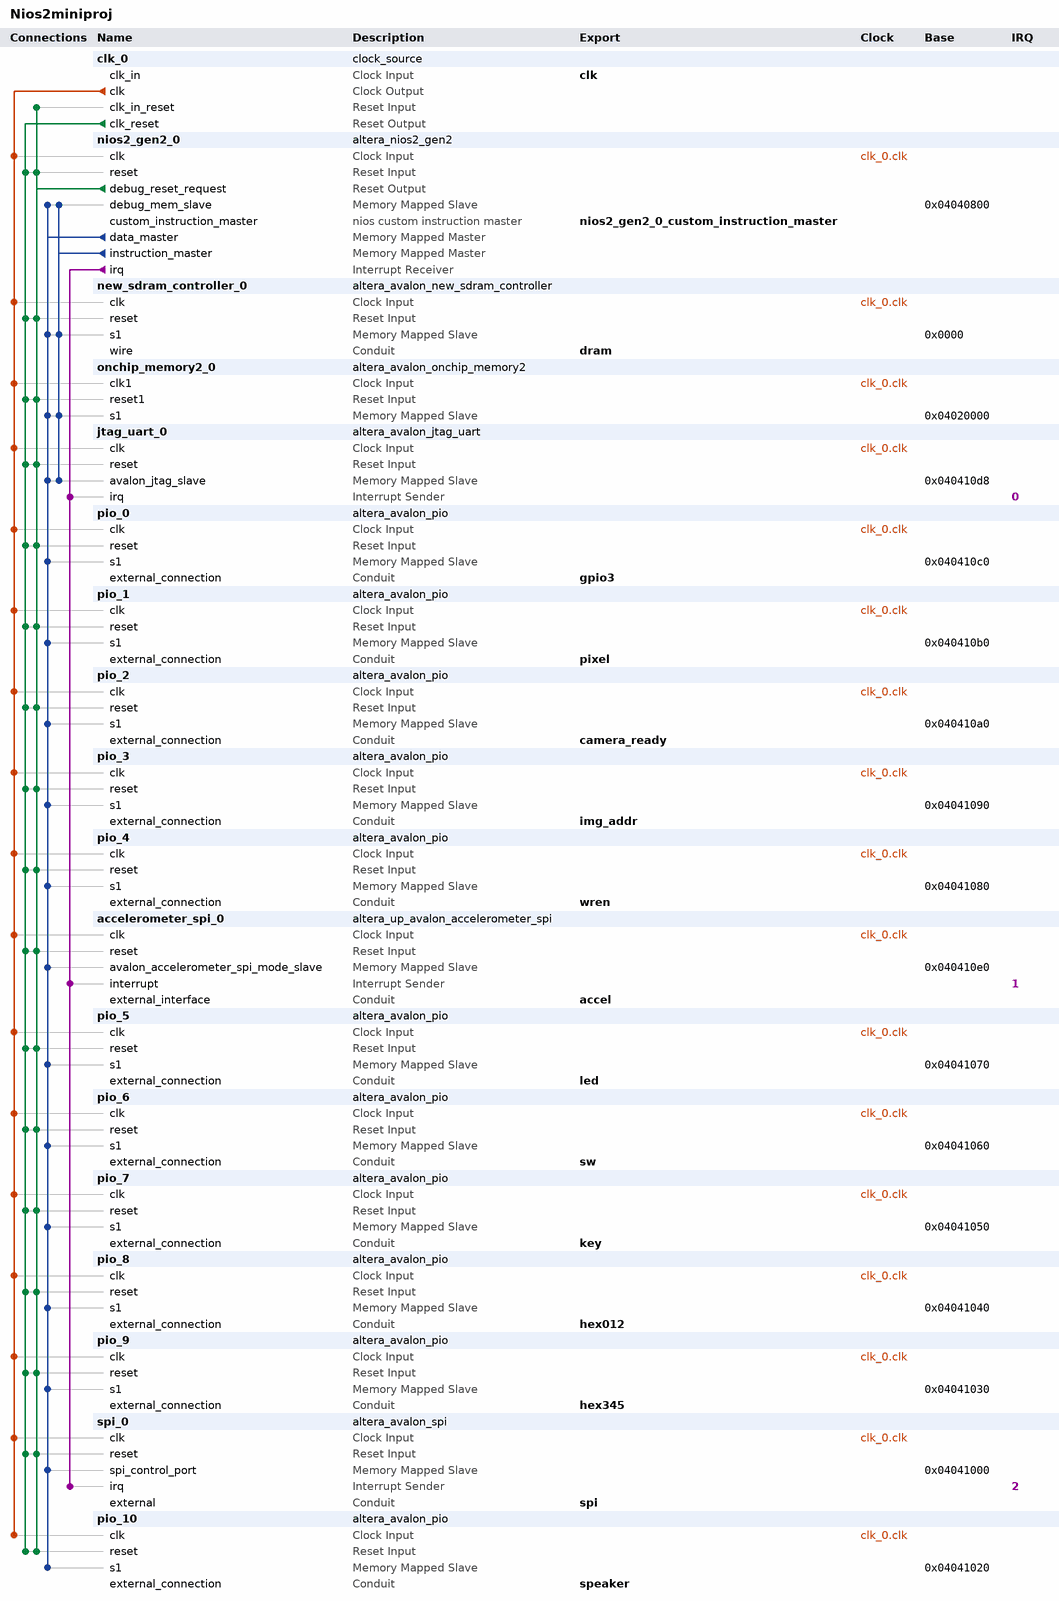
[diagram p0: system contents]
# Platform Designer (Qsys) system Nios2miniproj, MAX 10 10M50DAF484C7G
# Parameters at their usual value, and those the tool derives, are not listed.
package require -exact qsys 18.1
create_system Nios2miniproj
set_project_property DEVICE_FAMILY {MAX 10}
set_project_property DEVICE 10M50DAF484C7G

add_instance clk_0 clock_source 18.1
set_instance_parameter_value clk_0 clockFrequency 50000000

add_instance nios2_gen2_0 altera_nios2_gen2 18.1
set_instance_parameter_value nios2_gen2_0 dcache_size 2048
set_instance_parameter_value nios2_gen2_0 exceptionSlave new_sdram_controller_0.s1
set_instance_parameter_value nios2_gen2_0 icache_size 4096
set_instance_parameter_value nios2_gen2_0 impl Fast
set_instance_parameter_value nios2_gen2_0 resetSlave new_sdram_controller_0.s1

add_instance new_sdram_controller_0 altera_avalon_new_sdram_controller 18.1
set_instance_parameter_value new_sdram_controller_0 TAC 5.5
set_instance_parameter_value new_sdram_controller_0 TRCD 20.0
set_instance_parameter_value new_sdram_controller_0 TRP 20.0
set_instance_parameter_value new_sdram_controller_0 casLatency 3
set_instance_parameter_value new_sdram_controller_0 columnWidth 10
set_instance_parameter_value new_sdram_controller_0 dataWidth 16
set_instance_parameter_value new_sdram_controller_0 generateSimulationModel false
set_instance_parameter_value new_sdram_controller_0 model single_Micron_MT48LC4M32B2_7_chip
set_instance_parameter_value new_sdram_controller_0 numberOfBanks 4
set_instance_parameter_value new_sdram_controller_0 numberOfChipSelects 1
set_instance_parameter_value new_sdram_controller_0 powerUpDelay 100.0
set_instance_parameter_value new_sdram_controller_0 refreshPeriod 15.625
set_instance_parameter_value new_sdram_controller_0 rowWidth 13

add_instance onchip_memory2_0 altera_avalon_onchip_memory2 18.1
set_instance_parameter_value onchip_memory2_0 dataWidth 32
set_instance_parameter_value onchip_memory2_0 dualPort false
set_instance_parameter_value onchip_memory2_0 initMemContent true
set_instance_parameter_value onchip_memory2_0 initializationFileName onchip_mem.hex
set_instance_parameter_value onchip_memory2_0 memorySize 100000

add_instance jtag_uart_0 altera_avalon_jtag_uart 18.1
set_instance_parameter_value jtag_uart_0 simInteractiveOptions NO_INTERACTIVE_WINDOWS

add_instance pio_0 altera_avalon_pio 18.1
set_instance_parameter_value pio_0 direction Output
set_instance_parameter_value pio_0 width 1

add_instance pio_1 altera_avalon_pio 18.1
set_instance_parameter_value pio_1 direction Output
set_instance_parameter_value pio_1 width 4

add_instance pio_2 altera_avalon_pio 18.1
set_instance_parameter_value pio_2 direction Input
set_instance_parameter_value pio_2 width 1

add_instance pio_3 altera_avalon_pio 18.1
set_instance_parameter_value pio_3 direction Output
set_instance_parameter_value pio_3 width 17

add_instance pio_4 altera_avalon_pio 18.1
set_instance_parameter_value pio_4 direction Output
set_instance_parameter_value pio_4 width 1

add_instance accelerometer_spi_0 altera_up_avalon_accelerometer_spi 18.0

add_instance pio_5 altera_avalon_pio 18.1
set_instance_parameter_value pio_5 direction Output
set_instance_parameter_value pio_5 width 10

add_instance pio_6 altera_avalon_pio 18.1
set_instance_parameter_value pio_6 direction Input
set_instance_parameter_value pio_6 width 10

add_instance pio_7 altera_avalon_pio 18.1
set_instance_parameter_value pio_7 direction Input
set_instance_parameter_value pio_7 width 2

add_instance pio_8 altera_avalon_pio 18.1
set_instance_parameter_value pio_8 direction Output
set_instance_parameter_value pio_8 width 24

add_instance pio_9 altera_avalon_pio 18.1
set_instance_parameter_value pio_9 direction Output
set_instance_parameter_value pio_9 width 24

add_instance spi_0 altera_avalon_spi 18.1
set_instance_parameter_value spi_0 clockPhase 1
set_instance_parameter_value spi_0 clockPolarity 1
set_instance_parameter_value spi_0 dataWidth 8
set_instance_parameter_value spi_0 masterSPI true
set_instance_parameter_value spi_0 numberOfSlaves 2
set_instance_parameter_value spi_0 targetClockRate 5000000

add_instance pio_10 altera_avalon_pio 18.1
set_instance_parameter_value pio_10 direction Output
set_instance_parameter_value pio_10 width 1

# connections
add_connection clk_0.clk accelerometer_spi_0.clk clock
add_connection clk_0.clk jtag_uart_0.clk clock
add_connection clk_0.clk new_sdram_controller_0.clk clock
add_connection clk_0.clk nios2_gen2_0.clk clock
add_connection clk_0.clk onchip_memory2_0.clk1 clock
add_connection clk_0.clk pio_0.clk clock
add_connection clk_0.clk pio_1.clk clock
add_connection clk_0.clk pio_2.clk clock
add_connection clk_0.clk pio_3.clk clock
add_connection clk_0.clk pio_4.clk clock
add_connection clk_0.clk pio_5.clk clock
add_connection clk_0.clk pio_6.clk clock
add_connection clk_0.clk pio_7.clk clock
add_connection clk_0.clk pio_8.clk clock
add_connection clk_0.clk pio_9.clk clock
add_connection clk_0.clk pio_10.clk clock
add_connection clk_0.clk spi_0.clk clock
add_connection clk_0.clk_reset accelerometer_spi_0.reset reset
add_connection clk_0.clk_reset jtag_uart_0.reset reset
add_connection clk_0.clk_reset new_sdram_controller_0.reset reset
add_connection clk_0.clk_reset nios2_gen2_0.reset reset
add_connection clk_0.clk_reset onchip_memory2_0.reset1 reset
add_connection clk_0.clk_reset pio_0.reset reset
add_connection clk_0.clk_reset pio_1.reset reset
add_connection clk_0.clk_reset pio_2.reset reset
add_connection clk_0.clk_reset pio_3.reset reset
add_connection clk_0.clk_reset pio_4.reset reset
add_connection clk_0.clk_reset pio_5.reset reset
add_connection clk_0.clk_reset pio_6.reset reset
add_connection clk_0.clk_reset pio_7.reset reset
add_connection clk_0.clk_reset pio_8.reset reset
add_connection clk_0.clk_reset pio_9.reset reset
add_connection clk_0.clk_reset pio_10.reset reset
add_connection clk_0.clk_reset spi_0.reset reset
add_connection nios2_gen2_0.debug_reset_request accelerometer_spi_0.reset reset
add_connection nios2_gen2_0.debug_reset_request clk_0.clk_in_reset reset
add_connection nios2_gen2_0.debug_reset_request jtag_uart_0.reset reset
add_connection nios2_gen2_0.debug_reset_request new_sdram_controller_0.reset reset
add_connection nios2_gen2_0.debug_reset_request nios2_gen2_0.reset reset
add_connection nios2_gen2_0.debug_reset_request onchip_memory2_0.reset1 reset
add_connection nios2_gen2_0.debug_reset_request pio_0.reset reset
add_connection nios2_gen2_0.debug_reset_request pio_1.reset reset
add_connection nios2_gen2_0.debug_reset_request pio_2.reset reset
add_connection nios2_gen2_0.debug_reset_request pio_3.reset reset
add_connection nios2_gen2_0.debug_reset_request pio_4.reset reset
add_connection nios2_gen2_0.debug_reset_request pio_5.reset reset
add_connection nios2_gen2_0.debug_reset_request pio_6.reset reset
add_connection nios2_gen2_0.debug_reset_request pio_7.reset reset
add_connection nios2_gen2_0.debug_reset_request pio_8.reset reset
add_connection nios2_gen2_0.debug_reset_request pio_9.reset reset
add_connection nios2_gen2_0.debug_reset_request pio_10.reset reset
add_connection nios2_gen2_0.debug_reset_request spi_0.reset reset
add_connection nios2_gen2_0.data_master accelerometer_spi_0.avalon_accelerometer_spi_mode_slave avalon
set_connection_parameter_value nios2_gen2_0.data_master/accelerometer_spi_0.avalon_accelerometer_spi_mode_slave baseAddress 0x040410e0
add_connection nios2_gen2_0.data_master jtag_uart_0.avalon_jtag_slave avalon
set_connection_parameter_value nios2_gen2_0.data_master/jtag_uart_0.avalon_jtag_slave baseAddress 0x040410d8
add_connection nios2_gen2_0.data_master new_sdram_controller_0.s1 avalon
set_connection_parameter_value nios2_gen2_0.data_master/new_sdram_controller_0.s1 baseAddress 0x0000
add_connection nios2_gen2_0.data_master nios2_gen2_0.debug_mem_slave avalon
set_connection_parameter_value nios2_gen2_0.data_master/nios2_gen2_0.debug_mem_slave baseAddress 0x04040800
add_connection nios2_gen2_0.data_master onchip_memory2_0.s1 avalon
set_connection_parameter_value nios2_gen2_0.data_master/onchip_memory2_0.s1 baseAddress 0x04020000
add_connection nios2_gen2_0.data_master pio_0.s1 avalon
set_connection_parameter_value nios2_gen2_0.data_master/pio_0.s1 baseAddress 0x040410c0
add_connection nios2_gen2_0.data_master pio_1.s1 avalon
set_connection_parameter_value nios2_gen2_0.data_master/pio_1.s1 baseAddress 0x040410b0
add_connection nios2_gen2_0.data_master pio_2.s1 avalon
set_connection_parameter_value nios2_gen2_0.data_master/pio_2.s1 baseAddress 0x040410a0
add_connection nios2_gen2_0.data_master pio_3.s1 avalon
set_connection_parameter_value nios2_gen2_0.data_master/pio_3.s1 baseAddress 0x04041090
add_connection nios2_gen2_0.data_master pio_4.s1 avalon
set_connection_parameter_value nios2_gen2_0.data_master/pio_4.s1 baseAddress 0x04041080
add_connection nios2_gen2_0.data_master pio_5.s1 avalon
set_connection_parameter_value nios2_gen2_0.data_master/pio_5.s1 baseAddress 0x04041070
add_connection nios2_gen2_0.data_master pio_6.s1 avalon
set_connection_parameter_value nios2_gen2_0.data_master/pio_6.s1 baseAddress 0x04041060
add_connection nios2_gen2_0.data_master pio_7.s1 avalon
set_connection_parameter_value nios2_gen2_0.data_master/pio_7.s1 baseAddress 0x04041050
add_connection nios2_gen2_0.data_master pio_8.s1 avalon
set_connection_parameter_value nios2_gen2_0.data_master/pio_8.s1 baseAddress 0x04041040
add_connection nios2_gen2_0.data_master pio_9.s1 avalon
set_connection_parameter_value nios2_gen2_0.data_master/pio_9.s1 baseAddress 0x04041030
add_connection nios2_gen2_0.data_master pio_10.s1 avalon
set_connection_parameter_value nios2_gen2_0.data_master/pio_10.s1 baseAddress 0x04041020
add_connection nios2_gen2_0.data_master spi_0.spi_control_port avalon
set_connection_parameter_value nios2_gen2_0.data_master/spi_0.spi_control_port baseAddress 0x04041000
add_connection nios2_gen2_0.instruction_master jtag_uart_0.avalon_jtag_slave avalon
set_connection_parameter_value nios2_gen2_0.instruction_master/jtag_uart_0.avalon_jtag_slave baseAddress 0x040410d8
add_connection nios2_gen2_0.instruction_master new_sdram_controller_0.s1 avalon
set_connection_parameter_value nios2_gen2_0.instruction_master/new_sdram_controller_0.s1 baseAddress 0x0000
add_connection nios2_gen2_0.instruction_master nios2_gen2_0.debug_mem_slave avalon
set_connection_parameter_value nios2_gen2_0.instruction_master/nios2_gen2_0.debug_mem_slave baseAddress 0x04040800
add_connection nios2_gen2_0.instruction_master onchip_memory2_0.s1 avalon
set_connection_parameter_value nios2_gen2_0.instruction_master/onchip_memory2_0.s1 baseAddress 0x04020000
add_connection nios2_gen2_0.irq accelerometer_spi_0.interrupt interrupt
set_connection_parameter_value nios2_gen2_0.irq/accelerometer_spi_0.interrupt irqNumber 1
add_connection nios2_gen2_0.irq jtag_uart_0.irq interrupt
set_connection_parameter_value nios2_gen2_0.irq/jtag_uart_0.irq irqNumber 0
add_connection nios2_gen2_0.irq spi_0.irq interrupt
set_connection_parameter_value nios2_gen2_0.irq/spi_0.irq irqNumber 2

# exported interfaces
add_interface accel conduit end
set_interface_property accel EXPORT_OF accelerometer_spi_0.external_interface
add_interface camera_ready conduit end
set_interface_property camera_ready EXPORT_OF pio_2.external_connection
add_interface clk clock sink
set_interface_property clk EXPORT_OF clk_0.clk_in
add_interface dram conduit end
set_interface_property dram EXPORT_OF new_sdram_controller_0.wire
add_interface gpio3 conduit end
set_interface_property gpio3 EXPORT_OF pio_0.external_connection
add_interface hex012 conduit end
set_interface_property hex012 EXPORT_OF pio_8.external_connection
add_interface hex345 conduit end
set_interface_property hex345 EXPORT_OF pio_9.external_connection
add_interface img_addr conduit end
set_interface_property img_addr EXPORT_OF pio_3.external_connection
add_interface key conduit end
set_interface_property key EXPORT_OF pio_7.external_connection
add_interface led conduit end
set_interface_property led EXPORT_OF pio_5.external_connection
add_interface nios2_gen2_0_custom_instruction_master nios_custom_instruction start
set_interface_property nios2_gen2_0_custom_instruction_master EXPORT_OF nios2_gen2_0.custom_instruction_master
add_interface pixel conduit end
set_interface_property pixel EXPORT_OF pio_1.external_connection
add_interface speaker conduit end
set_interface_property speaker EXPORT_OF pio_10.external_connection
add_interface spi conduit end
set_interface_property spi EXPORT_OF spi_0.external
add_interface sw conduit end
set_interface_property sw EXPORT_OF pio_6.external_connection
add_interface wren conduit end
set_interface_property wren EXPORT_OF pio_4.external_connection

set_interconnect_requirement {$system} qsys_mm.clockCrossingAdapter HANDSHAKE
set_interconnect_requirement {$system} qsys_mm.enableEccProtection FALSE
set_interconnect_requirement {$system} qsys_mm.insertDefaultSlave FALSE
set_interconnect_requirement {$system} qsys_mm.maxAdditionalLatency 1

save_system Nios2miniproj.qsys
